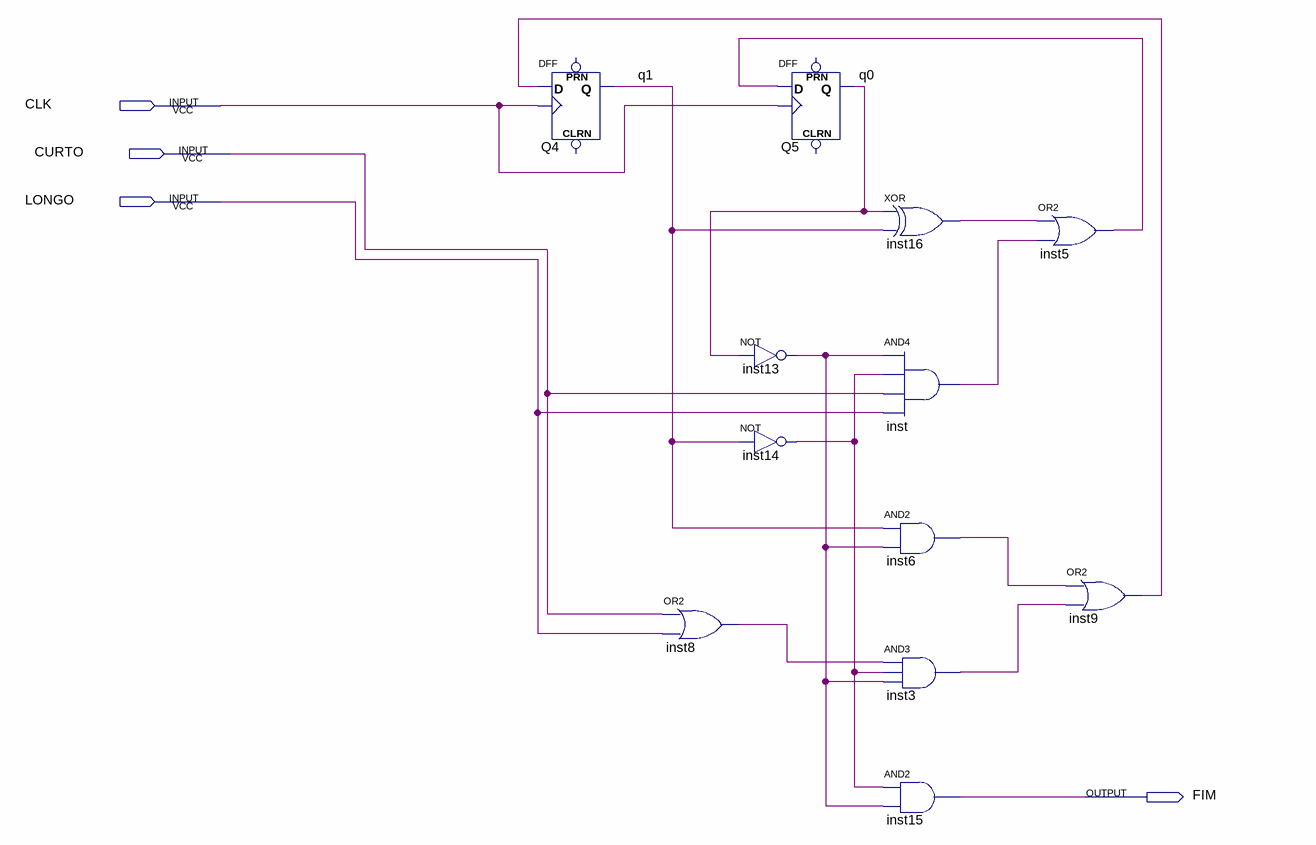
[diagram p0: schematic sheet]
// Quartus schematic Exercicio_2.bdf as structural Verilog: 12 symbols, 4 pins
module Exercicio_2 (
  input  CLK,
  input  CURTO,
  input  LONGO,
  output FIM
);

  wire inst3_out, inst5_out, inst6_out, inst8_out, inst9_out, inst13_out, inst14_out, inst16_out, inst_out,
       q0, q1;

  DFF Q4 (.CLK(CLK), .D(inst9_out), .Q(q1));  // open: CLRN, PRN
  or inst8 (inst8_out, CURTO, LONGO);
  DFF Q5 (.CLK(CLK), .D(inst5_out), .Q(q0));  // open: CLRN, PRN
  not inst13 (inst13_out, q0);
  not inst14 (inst14_out, q1);
  xor inst16 (inst16_out, q0, q1);
  and inst (inst_out, inst13_out, inst14_out, CURTO, LONGO);
  and inst6 (inst6_out, q1, inst13_out);
  and inst3 (inst3_out, inst8_out, inst14_out, inst13_out);
  and inst15 (FIM, inst14_out, inst13_out);
  or inst5 (inst5_out, inst16_out, inst_out);
  or inst9 (inst9_out, inst6_out, inst3_out);
endmodule
